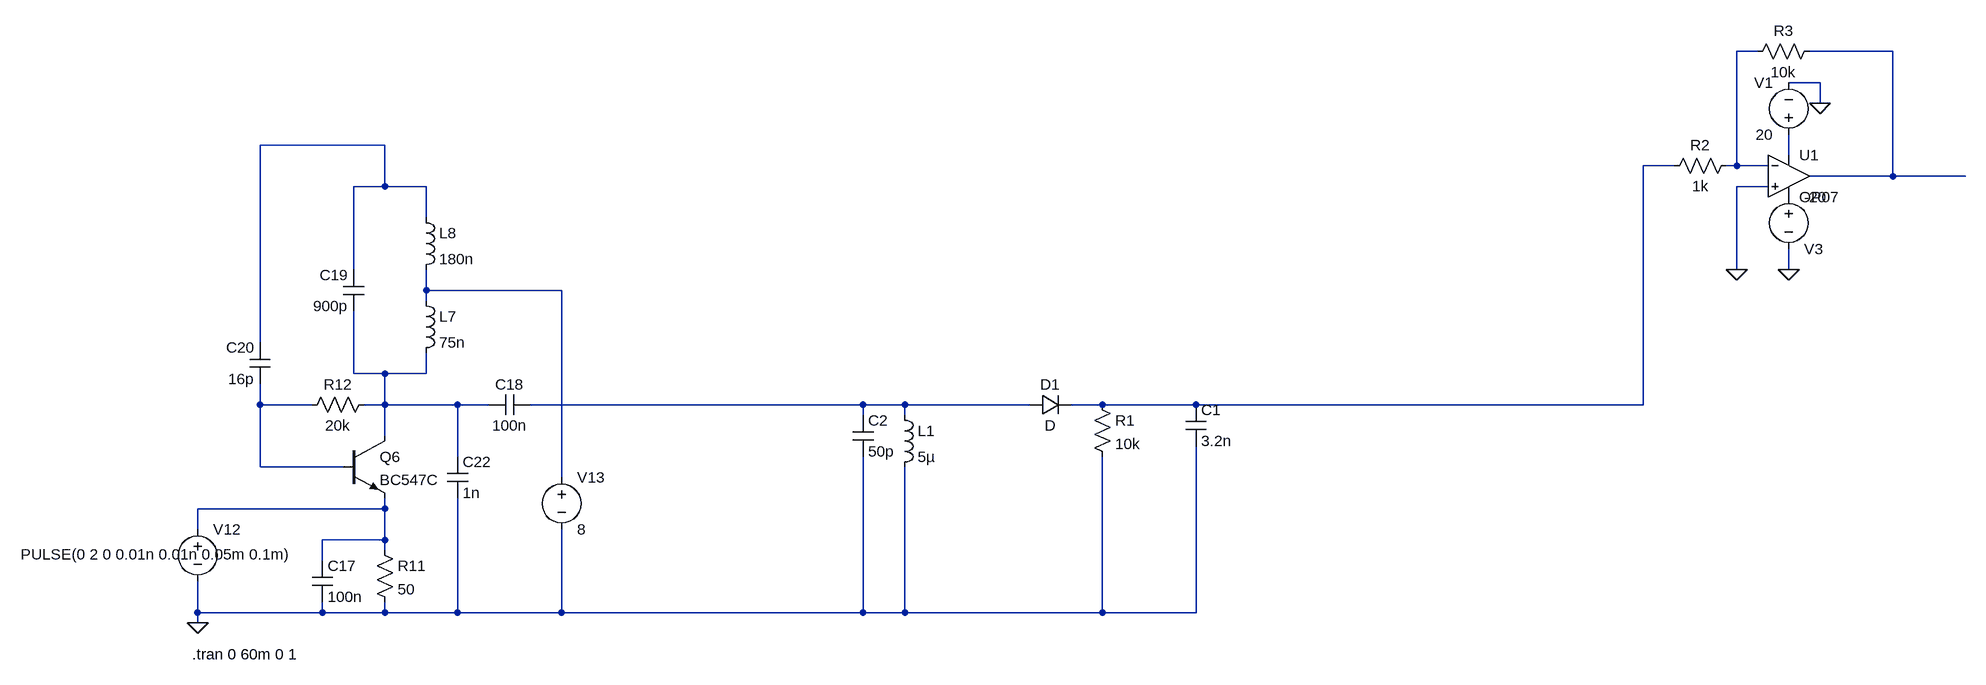
[diagram p0: schematic Empfaenger_Sender_progress.asc]
Empfaenger_Sender_progress.asc, the LTspice schematic file:
Version 4
SHEET 1 5860 1104
WIRE 2656 160 2624 160
WIRE 2864 160 2736 160
WIRE 2752 208 2704 208
WIRE 2752 240 2752 208
WIRE 544 304 352 304
WIRE 2704 320 2704 288
WIRE 2528 336 2480 336
WIRE 2624 336 2624 160
WIRE 2624 336 2608 336
WIRE 2672 336 2624 336
WIRE 2864 352 2864 160
WIRE 2864 352 2736 352
WIRE 2976 352 2864 352
WIRE 544 368 544 304
WIRE 544 368 496 368
WIRE 608 368 544 368
WIRE 2672 368 2624 368
WIRE 608 416 608 368
WIRE 496 496 496 368
WIRE 2624 496 2624 368
WIRE 2704 496 2704 464
WIRE 608 528 608 496
WIRE 816 528 608 528
WIRE 608 544 608 528
WIRE 352 608 352 304
WIRE 496 656 496 560
WIRE 544 656 496 656
WIRE 608 656 608 624
WIRE 608 656 544 656
WIRE 352 704 352 672
WIRE 432 704 352 704
WIRE 544 704 544 656
WIRE 544 704 512 704
WIRE 656 704 544 704
WIRE 704 704 656 704
WIRE 1280 704 768 704
WIRE 1344 704 1280 704
WIRE 1536 704 1344 704
WIRE 1648 704 1600 704
WIRE 1792 704 1648 704
WIRE 2480 704 2480 336
WIRE 2480 704 1792 704
WIRE 1280 720 1280 704
WIRE 1344 720 1344 704
WIRE 544 752 544 704
WIRE 656 784 656 704
WIRE 352 800 352 704
WIRE 480 800 352 800
WIRE 816 816 816 528
WIRE 544 864 544 848
WIRE 544 864 256 864
WIRE 256 896 256 864
WIRE 544 912 544 864
WIRE 544 912 448 912
WIRE 544 928 544 912
WIRE 448 944 448 912
WIRE 256 1024 256 976
WIRE 448 1024 448 1008
WIRE 448 1024 256 1024
WIRE 544 1024 544 1008
WIRE 544 1024 448 1024
WIRE 656 1024 656 848
WIRE 656 1024 544 1024
WIRE 816 1024 816 896
WIRE 816 1024 656 1024
WIRE 1280 1024 1280 784
WIRE 1280 1024 816 1024
WIRE 1344 1024 1344 800
WIRE 1344 1024 1280 1024
WIRE 1648 1024 1648 784
WIRE 1648 1024 1344 1024
WIRE 1792 1024 1792 768
WIRE 1792 1024 1648 1024
WIRE 256 1040 256 1024
FLAG 256 1040 0
FLAG 2624 496 0
FLAG 2752 240 0
FLAG 2704 496 0
SYMBOL res 528 912 R0
SYMATTR InstName R11
SYMATTR Value 50
SYMBOL cap 432 944 R0
SYMATTR InstName C17
SYMATTR Value 100n
SYMBOL res 528 688 R90
WINDOW 0 0 56 VBottom 2
WINDOW 3 32 56 VTop 2
SYMATTR InstName R12
SYMATTR Value 20k
SYMBOL cap 768 688 R90
WINDOW 0 0 32 VBottom 2
WINDOW 3 32 32 VTop 2
SYMATTR InstName C18
SYMATTR Value 100n
SYMBOL cap 512 560 R180
WINDOW 0 24 56 Left 2
WINDOW 3 24 8 Left 2
SYMATTR InstName C19
SYMATTR Value 900p
SYMBOL cap 368 672 R180
WINDOW 0 24 56 Left 2
WINDOW 3 24 8 Left 2
SYMATTR InstName C20
SYMATTR Value 16p
SYMBOL ind 592 528 R0
SYMATTR InstName L7
SYMATTR Value 75n
SYMBOL ind 592 400 R0
SYMATTR InstName L8
SYMATTR Value 180n
SYMBOL voltage 256 880 R0
WINDOW 123 0 0 Left 0
WINDOW 39 0 0 Left 0
WINDOW 3 -272 54 Left 2
SYMATTR Value PULSE(0 2 0 0.01n 0.01n 0.05m 0.1m)
SYMATTR InstName V12
SYMBOL voltage 816 800 R0
WINDOW 123 0 0 Left 0
WINDOW 39 0 0 Left 0
SYMATTR InstName V13
SYMATTR Value 8
SYMBOL npn 480 752 R0
SYMATTR InstName Q6
SYMATTR Value BC547C
SYMBOL cap 640 784 R0
SYMATTR InstName C22
SYMATTR Value 1n
SYMBOL diode 1536 720 R270
WINDOW 0 32 32 VTop 2
WINDOW 3 0 32 VBottom 2
SYMATTR InstName D1
SYMBOL cap 1264 720 R0
SYMATTR InstName C2
SYMATTR Value 50p
SYMBOL ind 1328 704 R0
SYMATTR InstName L1
SYMATTR Value 5µ
SYMBOL cap 1776 704 R0
SYMATTR InstName C1
SYMATTR Value 3.2n
SYMBOL res 1632 688 R0
SYMATTR InstName R1
SYMATTR Value 10k
SYMBOL Opamps\\OP07 2704 288 R0
SYMATTR InstName U1
SYMBOL voltage 2704 304 R180
WINDOW 0 24 96 Left 2
WINDOW 3 24 16 Left 2
WINDOW 123 0 0 Left 0
WINDOW 39 0 0 Left 0
SYMATTR InstName V1
SYMATTR Value 20
SYMBOL res 2624 320 R90
WINDOW 0 0 56 VBottom 2
WINDOW 3 32 56 VTop 2
SYMATTR InstName R2
SYMATTR Value 1k
SYMBOL res 2752 144 R90
WINDOW 0 0 56 VBottom 2
WINDOW 3 32 56 VTop 2
SYMATTR InstName R3
SYMATTR Value 10k
SYMBOL voltage 2704 368 R0
WINDOW 0 24 96 Left 2
WINDOW 3 24 16 Left 2
WINDOW 123 0 0 Left 0
WINDOW 39 0 0 Left 0
SYMATTR InstName V3
SYMATTR Value -20
TEXT 248 1088 Left 2 !.tran 0 60m 0 1

The netlist it stands for:
* Empfaenger_Sender_progress.asc
R11 N010 0 50
C17 N010 0 100n
R12 N007 N008 20k
C18 N009 N007 100n
C19 N007 N003 900p
C20 N008 N003 16p
L7 N006 N007 75n
L8 N003 N006 180n
V12 N010 0 PULSE(0 2 0 0.01n 0.01n 0.05m 0.1m)
V13 N006 0 8
Q6 N007 N008 N010 0 BC547C
C22 N007 0 1n
D1 N009 N005 D
C2 N009 0 50p
L1 N009 0 5µ
C1 N005 0 3.2n
R1 N005 0 10k
XU1 0 N001 N004 P001 N002 LT1001  ; OP07, pins In+ In- V+ V- OUT
V1 N004 0 20
R2 N001 N005 1k
R3 N002 N001 10k
V3 P001 0 -20
.model D D
.lib standard.dio
.model NPN NPN
.model PNP PNP
.lib standard.bjt
.tran 0 60m 0 1
.lib LTC.lib
.backanno
.end